# EAGLE design tiefentladungsschutz (EAGLE 5.01)
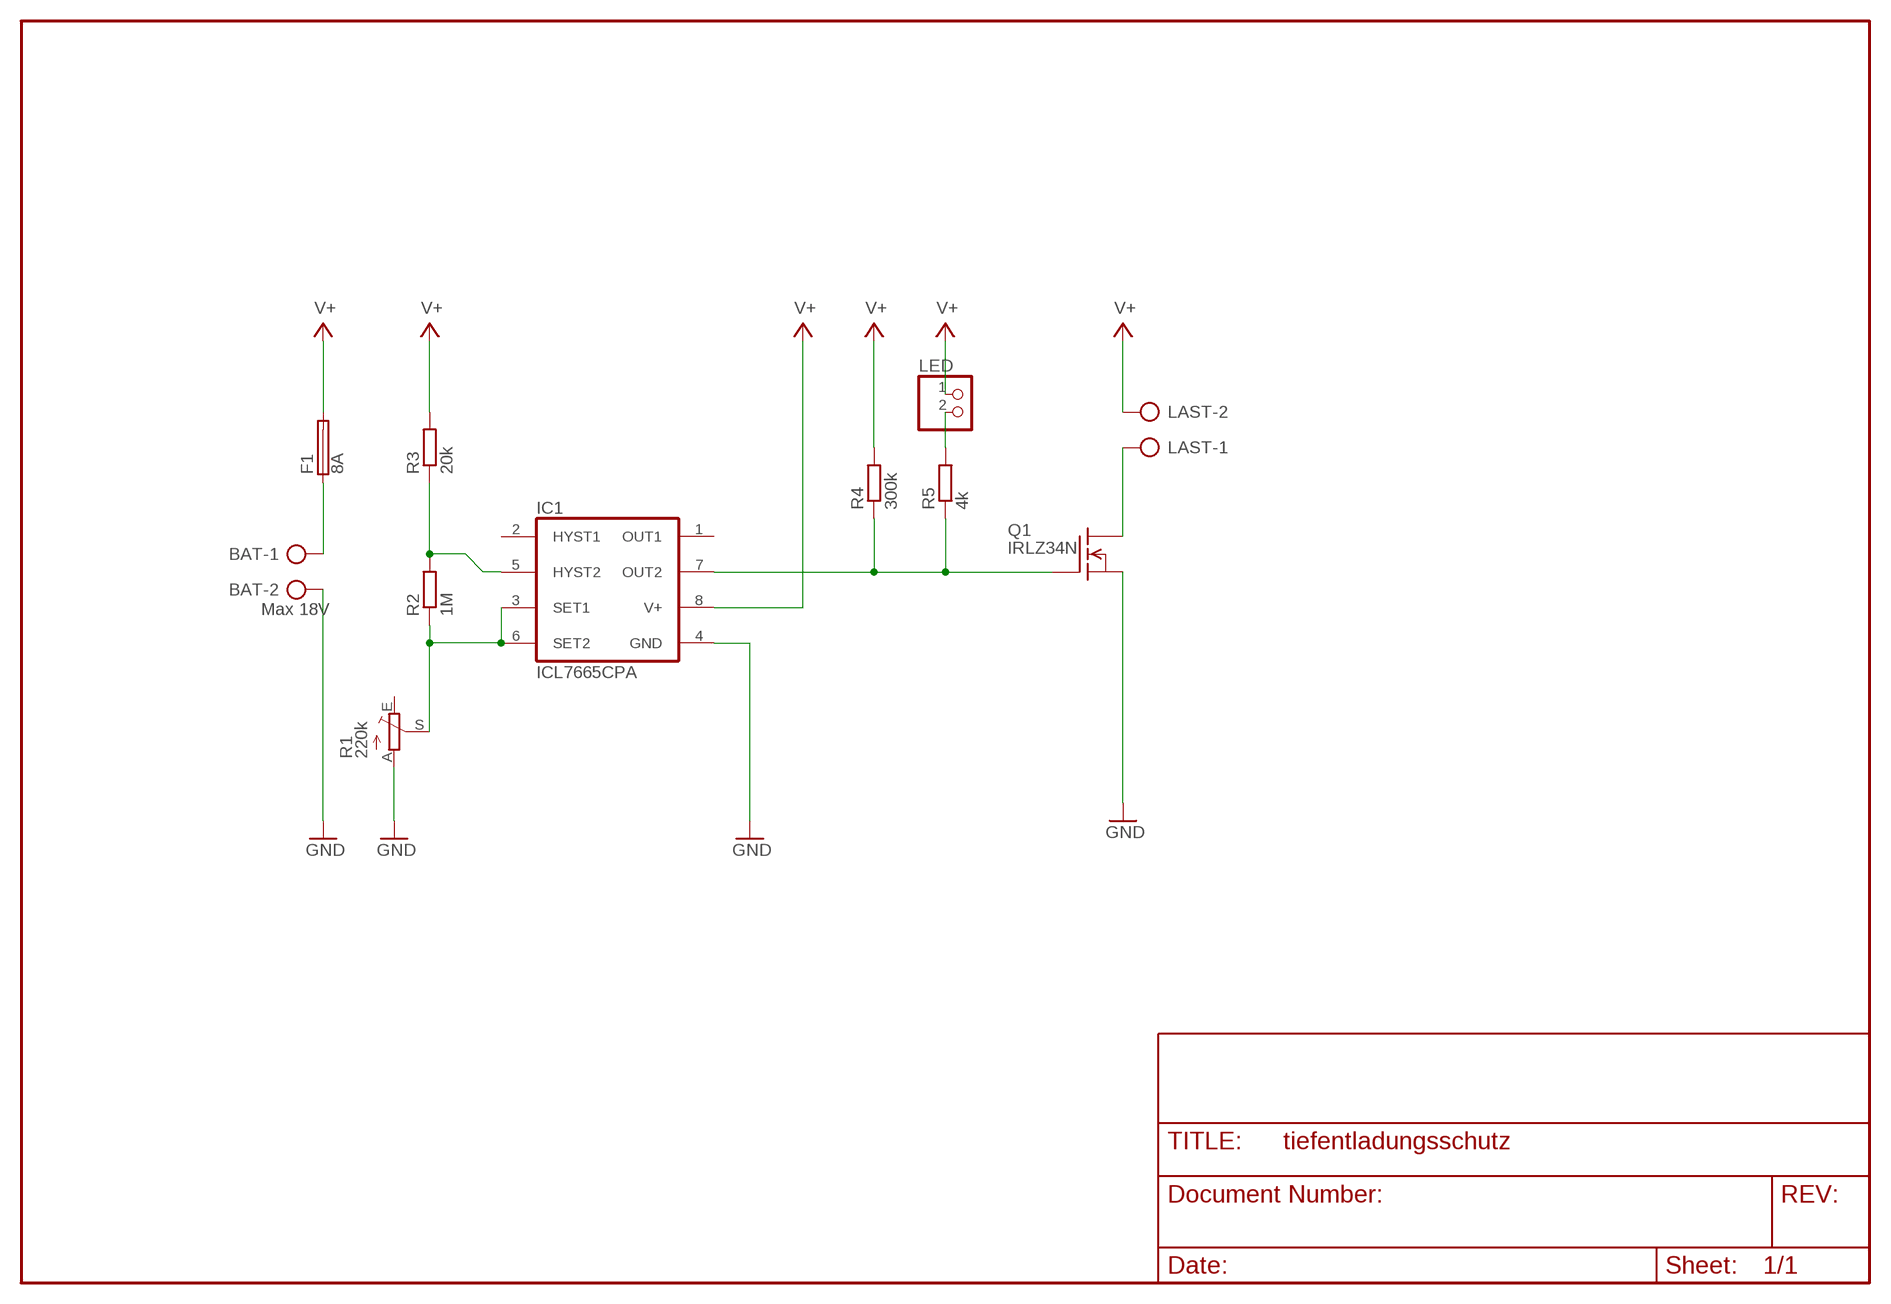
[diagram p0: schematic, sheet 1]

## Parts
BAT  Max 18V  AK500/2  [AK500/2]
F1  8A  LITTLEFUSE  [LITTLEFUSE]
IC1  ICL7665CPA  [DIL08]
LAST  AK500/2  [AK500/2]
LED  PINHD-1X2  [1X02]
Q1  IRLZ34N  IRF540  [TO220]
R1  220k  TRIM_EU-CA14V  [CA14V]
R2  1M  R-EU_0207/12  [0207/12]
R3  20k  R-EU_0207/12  [0207/12]
R4  300k  R-EU_0207/12  [0207/12]
R5  4k  R-EU_0207/12  [0207/12]

## Nets
GND: BAT.2 IC1.4(GND) Q1.3(S) R1.A
N$1: IC1.7(OUT2) Q1.1(G) R4.1 R5.1
N$2: IC1.3(SET1) IC1.6(SET2) R1.S R2.1
N$3: IC1.5(HYST2) R2.2 R3.1
N$4: BAT.1 F1.1
N$5: LAST.1 Q1.2(D)
N$6: LED.2 R5.2
V+: F1.2 IC1.8(V+) LAST.2 LED.1 R3.2 R4.2
Unconnected: IC1.1(OUT1) IC1.2(HYST1) R1.E

## Library data of the parts
BAT LAST = con-ptr500:AK500/2: CONNECTOR
F1 = fuse:LITTLEFUSE: LITTLEFUSE Picofuse/slow Littlefuse
IC1 = maxim:ICL7665CPA: UNDER/OVER VOLTAGE DETECTOR
LED = pinhead:PINHD-1X2: PIN HEADER
Q1 = transistor-fet:IRF540: N-Channel Enhancement MOSFET (HEXFET); 100V; 28A; 0,077Ohm
R1 = pot:TRIM_EU-: POTENTIOMETER
R2-R5 = rcl:R-EU_: RESISTOR, European symbol

## Board
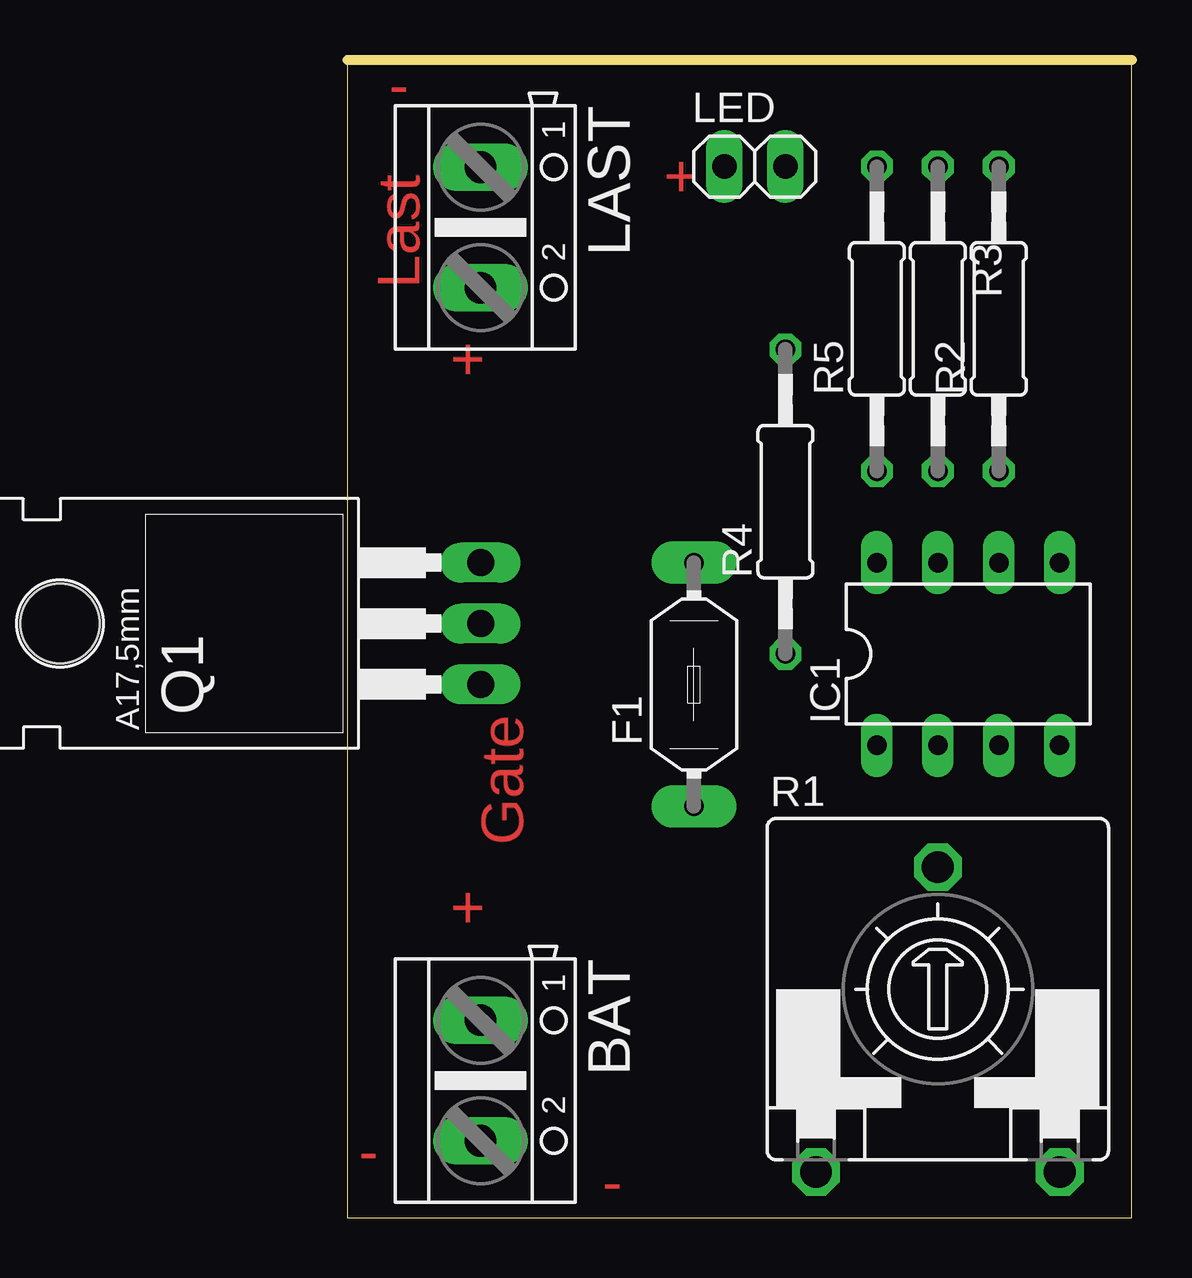
[diagram p1: board, top side]
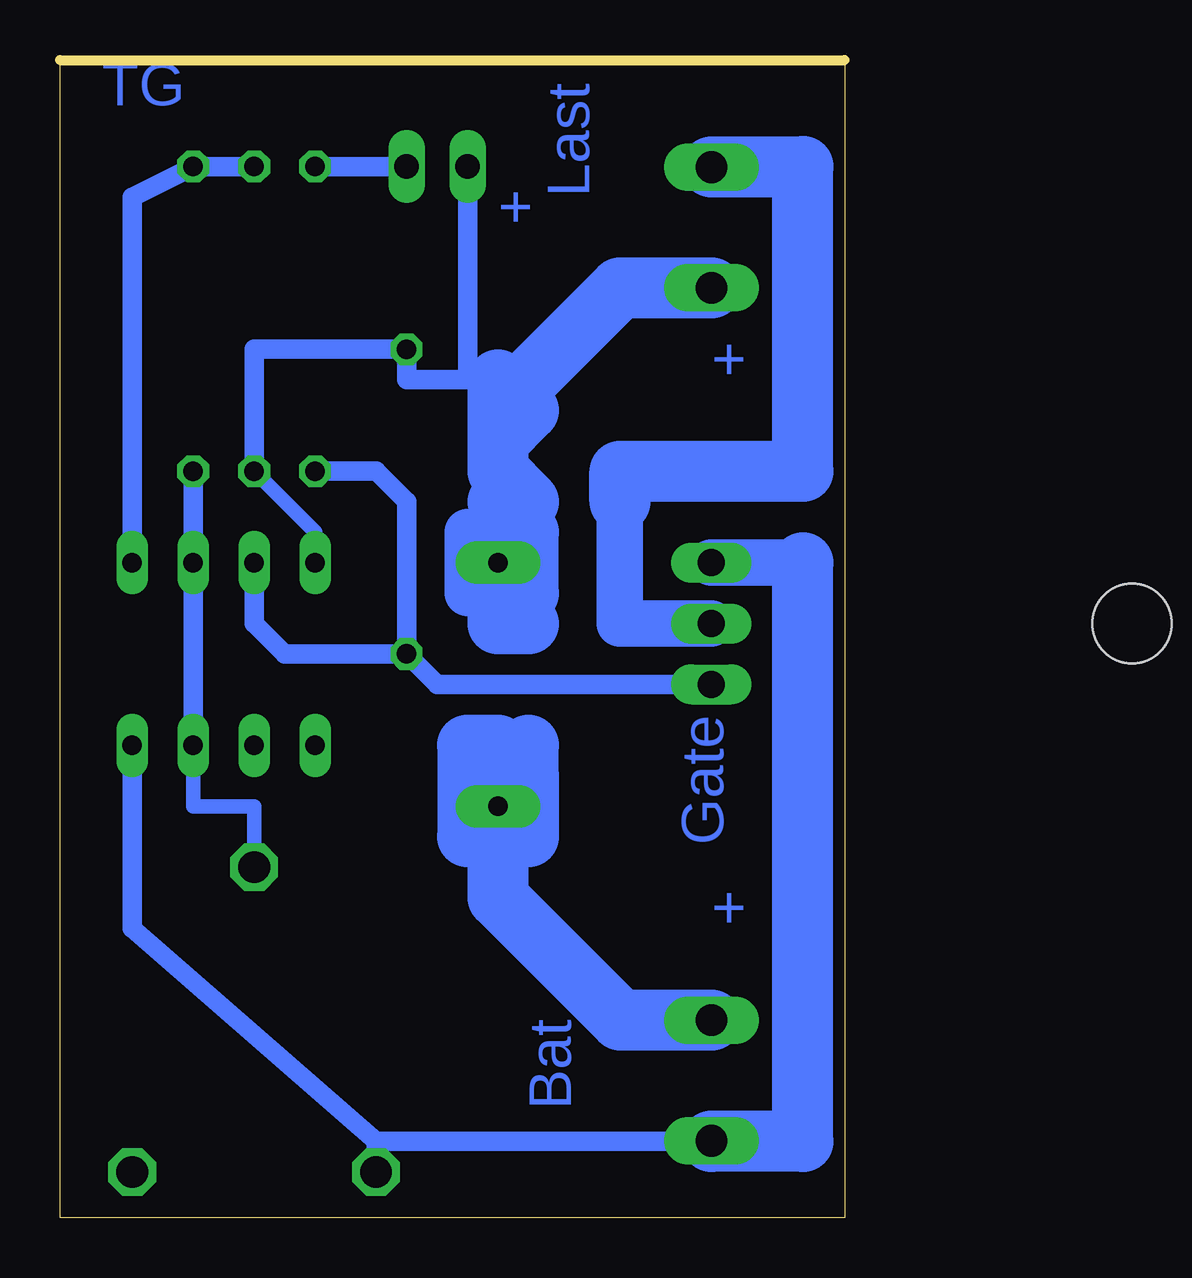
[diagram p2: board, bottom side, seen from below]

Size 32.69 x 48.25 mm. Coordinates in mm from the lower left corner, seen from the top.
Outline: 0,0 32.69,0 32.69,48.25 0,48.25 0,0
Copper layers (1*16): Top 0.035mm / dielectric 1.5mm / Bottom 0.035mm
Design rules "default": minimum track width 10mil, minimum drill 24mil, track to track 8mil, track to pad 8mil, pad to pad 8mil, via to via 8mil, smd to smd 8mil, copper to edge 40mil, drill to drill 8mil, minimum pad ring 10mil, minimum via ring 8mil, stop-mask expansion 4mil, vias tented up to drill 0mil, thermal gap 10mil

### Footprints (pad centres in the part's own frame; a part is rotated, then mirrored left to right if it is on the bottom)
AK500/2 = drill 1.321 long: 1 -2.515,0; 2 2.515,0
LITTLEFUSE = drill 0.813 pad 1.778 long: 1 -5.08,0; 2 5.08,0
DIL08 = drill 0.813 long: 1 -3.81,-3.81; 2 -1.27,-3.81; 3 1.27,-3.81; 4 3.81,-3.81; 5 3.81,3.81; 6 1.27,3.81; 7 -1.27,3.81; 8 -3.81,3.81
1X02 = drill 1.016 long: 1 -1.27,0; 2 1.27,0
TO220 = drill 1.118 long: 1 -2.54,-6.35; 2 0,-6.35; 3 2.54,-6.35 | hole 3.302: 0,11.176
CA14V = drill 1.321 octagon: A -5.08,-7.62; E 5.08,-7.62; S 0,5.08
0207/12 = drill 0.813 octagon: 1 -6.35,0; 2 6.35,0

### Placement (x,y rotation side)
BAT  5.55,5.71 270 top
F1  14.44,22.22 90 top
IC1  25.87,23.49 0 top
LAST  5.55,41.27 270 top
LED  16.98,43.81 0 top
Q1  -0.8,24.76 90 top
R1  24.6,9.52 0 top
R2  27.14,37.46 90 top
R3  24.6,37.46 270 top
R4  18.25,29.84 90 top
R5  22.06,37.46 90 top

### Tracks (layer width: path | path; a pad name or v marks a point on that pad's centre or on a via)
GND
  Bottom 0.813: IC1.4 29.68,12.06 19.52,3.17 | 5.55,3.17 19.52,3.17 | 19.52,3.17 R1.A
  Bottom 1.93: 1.74,27.3 Q1.3
  Bottom 2.54: 1.74,27.3 1.74,3.17 5.55,3.17 BAT.2
N$1
  Bottom 0.813: Q1.1 16.98,22.22 R4.1 | R4.1 23.33,23.49 24.6,24.76 IC1.7 | R5.1 19.52,31.11 18.25,29.84 R4.1
N$2
  Bottom 0.61: IC1.3 27.14,17.14 24.6,17.14 R1.S
  Bottom 0.813: IC1.3 IC1.6 R2.1
N$3
  Bottom 0.813: IC1.5 29.68,42.54 R2.2 R3.1
N$4
  Bottom 2.54: BAT.1 9.34,8.22 14.44,13.33 F1.1 | F1.1 14.44,19.68 15.71,19.68 15.71,15.87 13.17,15.87 13.17,18.41 | 13.17,18.41 13.17,19.68 | F1.1 13.17,18.41
N$5
  Bottom 1.93: Q1.2 9.36,24.76 9.36,29.84
  Bottom 2.54: 1.74,43.79 LAST.1 | 1.74,43.79 1.74,43.81 | 9.36,29.84 9.36,31.11 1.74,31.11 1.74,43.79
N$6
  Bottom 0.813: LED.2 R5.2
V+
  Bottom 0.61: IC1.8 22.06,28.57 R3.2
  Bottom 0.813: 15.71,34.92 14.44,34.92 13.17,34.92 13.17,33.65 | 15.71,34.92 18.25,34.92 R4.2 24.6,36.19 R3.2 | 15.71,34.92 LED.1
  Bottom 1.93: F1.2 13.17,26.03 | F1.2 15.71,28.57 15.71,26.03 F1.2
  Bottom 2.54: LAST.2 9.36,38.76 9.36,38.73 13.17,34.92 | 13.17,24.76 14.44,24.76 F1.2 | 13.17,33.65 14.44,32.38 14.44,34.92 14.44,31.11 13.17,29.84 14.44,29.84 13.17,28.57 13.17,26.03

### Text on the board
Top: - | + | Last | + | Gate | + | - | -
Bottom: TG | Last | + | + | Gate | + | Bat